# EAGLE design rcstick-f-pico (EAGLE 9.6.2)
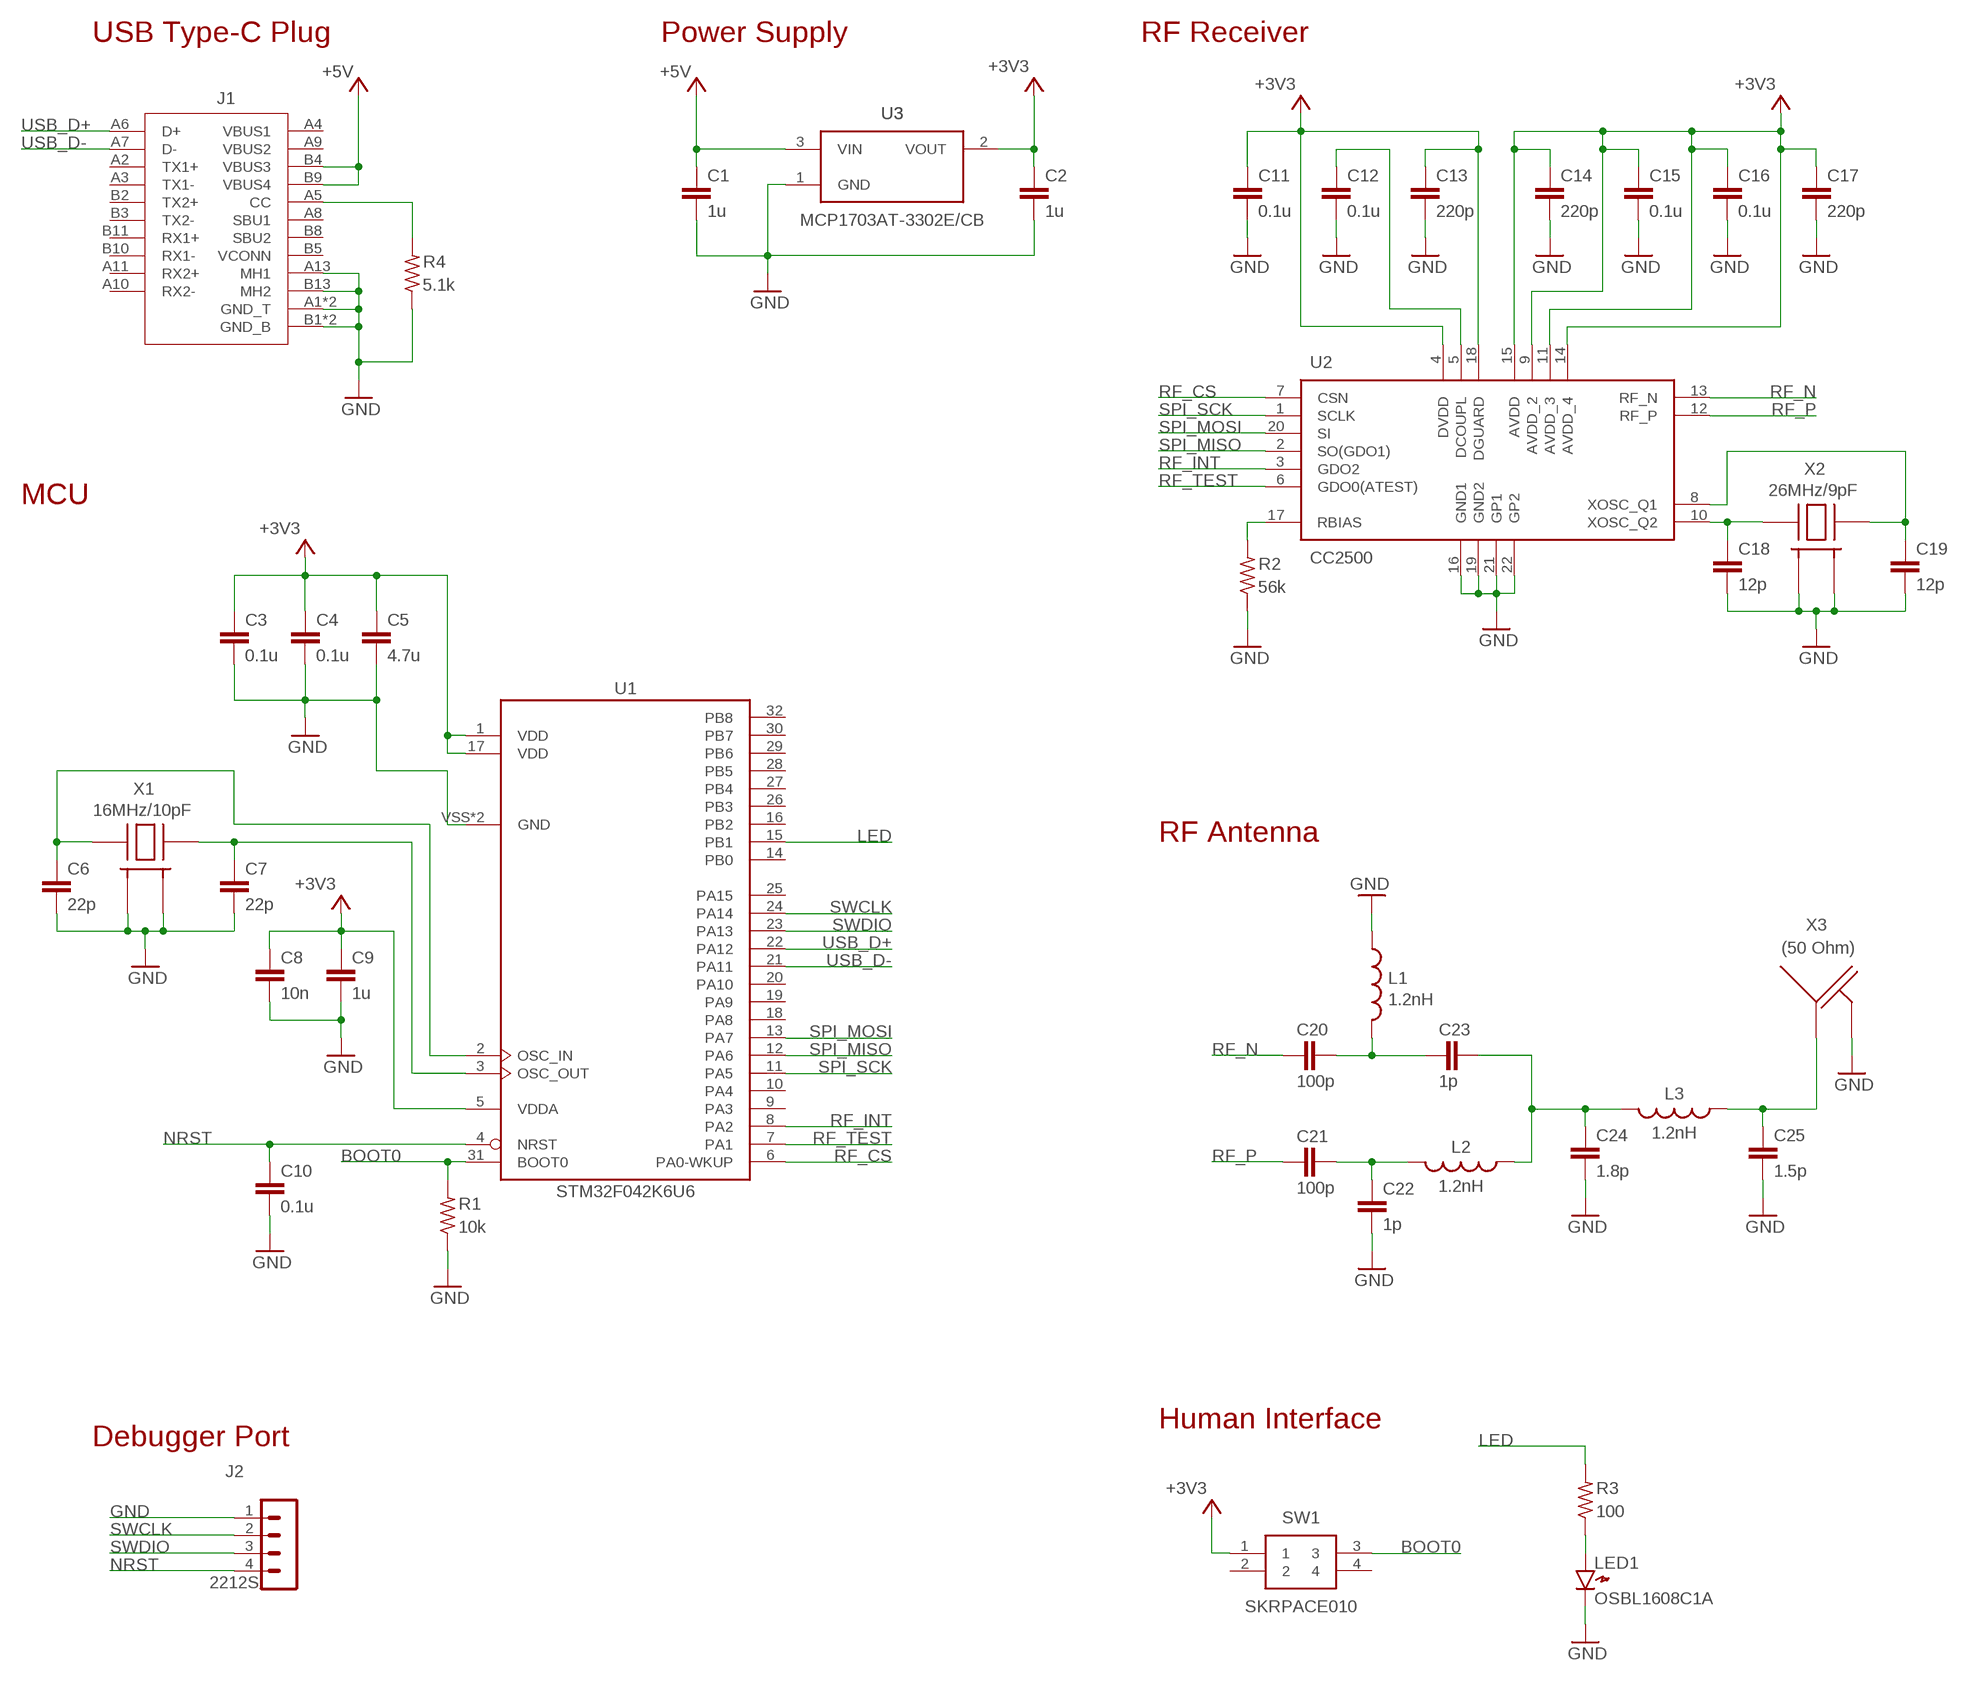
[diagram p0: schematic, sheet 1]

## Parts
C1  1u  RCL_C-EUC0402-HS  [RCL_C0402_HS]
C2  1u  RCL_C-EUC0402-HS  [RCL_C0402_HS]
C3  0.1u  RCL_C-EUC0402-HS  [RCL_C0402_HS]
C4  0.1u  RCL_C-EUC0402-HS  [RCL_C0402_HS]
C5  4.7u  RCL_C-EUC0402-HS  [RCL_C0402_HS]
C6  22p  RCL_C-EUC0402-HS  [RCL_C0402_HS]
C7  22p  RCL_C-EUC0402-HS  [RCL_C0402_HS]
C8  10n  RCL_C-EUC0402-HS  [RCL_C0402_HS]
C9  1u  RCL_C-EUC0402-HS  [RCL_C0402_HS]
C10  0.1u  RCL_C-EUC0402-HS  [RCL_C0402_HS]
C11  0.1u  RCL_C-EUC0402-HS  [RCL_C0402_HS]
C12  0.1u  RCL_C-EUC0402-HS  [RCL_C0402_HS]
C13  220p  RCL_C-EUC0402-HS  [RCL_C0402_HS]
C14  220p  RCL_C-EUC0402-HS  [RCL_C0402_HS]
C15  0.1u  RCL_C-EUC0402-HS  [RCL_C0402_HS]
C16  0.1u  RCL_C-EUC0402-HS  [RCL_C0402_HS]
C17  220p  RCL_C-EUC0402-HS  [RCL_C0402_HS]
C18  12p  RCL_C-EUC0402-HS  [RCL_C0402_HS]
C19  12p  RCL_C-EUC0402-HS  [RCL_C0402_HS]
C20  100p  RCL_C-EUC0402-HS  [RCL_C0402_HS]
C21  100p  RCL_C-EUC0402-HS  [RCL_C0402_HS]
C22  1p  RCL_C-EUC0402-HS  [RCL_C0402_HS]
C23  1p  RCL_C-EUC0402-HS  [RCL_C0402_HS]
C24  1.8p  RCL_C-EUC0402-HS  [RCL_C0402_HS]
C25  1.5p  RCL_C-EUC0402-HS  [RCL_C0402_HS]
J1  USB-TYPEC-1054440001-HS  [USB-TYPEC-1054440001-HS]
J2  2212S  53047-0410  [53047-0410]
L1  1.2nH  RCL_L-USL0402-HS  [RCL_L0402_HS]
L2  1.2nH  RCL_L-USL0402-HS  [RCL_L0402_HS]
L3  1.2nH  RCL_L-USL0402-HS  [RCL_L0402_HS]
LED1  OSBL1608C1A  LED1608  [LED1608]
R1  10k  RCL_R-US_R0402-HS  [RCL_R0402_HS]
R2  56k  RCL_R-US_R0402-HS  [RCL_R0402_HS]
R3  100  RCL_R-US_R0402-HS  [RCL_R0402_HS]
R4  5.1k  RCL_R-US_R0402-HS  [RCL_R0402_HS]
SW1  SKRPACE010  [SMT(4.2X3.2)]
U1  STM32F042K6U6  STM32F042K6U-M  [UQFPN32-M]
U2  CC2500  CC2500-HS  [CC2500-RTY1_CC2500-HS]
U3  MCP1703AT-3302E/CB  LDO-REGULATOR  [SOT23]
X1  16MHz/10pF  CRYSTAL3225HS  [CRYSTAL3225-HS]
X2  26MHz/9pF  CRYSTAL3225HS  [CRYSTAL3225-HS]
X3  (50 Ohm)  2.4GHZ-INVERED-FSMALL-FLIP  [2.4GHZ-INVERTED-F-SMALL-FLIP]

## Nets
+3V3 [pwr]: C2.1 C3.1 C4.1 C5.1 C8.1 C9.1 C11.1 C13.1 C14.1 C15.1 C16.1 C17.1 SW1.1 U1.1(VDD) U1.5(VDDA) U1.17(VDD) U2.4(DVDD) U2.9(AVDD_2) U2.11(AVDD_3) U2.14(AVDD_4) U2.15(AVDD) U2.18(DGUARD) U3.2(VOUT)
+5V [pwr]: C1.1 J1.B4(VBUS3) J1.B9(VBUS4) U3.3(VIN)
BOOT0: R1.2 SW1.3 U1.31(BOOT0)
CC: J1.A5(CC) R4.2
DCOUPL: C12.1 U2.5(DCOUPL)
GND [gnd]: C1.2 C2.2 C3.2 C4.2 C5.2 C6.2 C7.2 C8.2 C9.2 C10.2 C11.2 C12.2 C13.2 C14.2 C15.2 C16.2 C17.2 C18.2 C19.2 C22.2 C24.2 C25.2 J1.A1(GND_T) J1.A12(GND_T) J1.A13(MH1) J1.B1(GND_B) J1.B12(GND_B) J1.B13(MH2) J2.1 L1.1 LED1.K R1.1 R2.1 R4.1 U1.VSS(GND) U1.VSSH(GND) U2.16(GND1) U2.19(GND2) U2.21(GP1) U2.22(GP2) U3.1(GND) X1.2(GND_1) X1.4(GND_2) X2.2(GND_1) X2.4(GND_2) X3.2(GND)
LED: R3.2 U1.15(PB1)
N$1: LED1.A R3.1
N$5: C20.2 C23.1 L1.2
N$9: C21.2 C22.1 L2.2
N$10: C23.2 C24.1 L2.1 L3.2
N$11: C25.1 L3.1 X3.1(ANT)
NRST: C10.1 J2.4 U1.4(NRST)
OSC_IN: C6.1 U1.2(OSC_IN) X1.1(HOT_1)
OSC_OUT: C7.1 U1.3(OSC_OUT) X1.3(HOT_2)
RBIAS: R2.2 U2.17(RBIAS)
RF_CS: U1.6(PA0-WKUP) U2.7(CSN)
RF_INT: U1.8(PA2) U2.3(GDO2)
RF_N: C20.1 U2.13(RF_N)
RF_P: C21.1 U2.12(RF_P)
RF_TEST: U1.7(PA1) U2.6(GDO0(ATEST))
SPI_MISO: U1.12(PA6) U2.2(SO(GDO1))
SPI_MOSI: U1.13(PA7) U2.20(SI)
SPI_SCK: U1.11(PA5) U2.1(SCLK)
SWCLK: J2.2 U1.24(PA14)
SWDIO: J2.3 U1.23(PA13)
USB_D+: J1.A6(D+) U1.22(PA12)
USB_D-: J1.A7(D-) U1.21(PA11)
XOSC1: C19.1 U2.8(XOSC_Q1) X2.3(HOT_2)
XOSC2: C18.1 U2.10(XOSC_Q2) X2.1(HOT_1)
Unconnected: J1.A2(TX1+) J1.A3(TX1-) J1.A4(VBUS1) J1.A8(SBU1) J1.A9(VBUS2) J1.A10(RX2-) J1.A11(RX2+) J1.B2(TX2+) J1.B3(TX2-) J1.B5(VCONN) J1.B8(SBU2) J1.B10(RX1-) J1.B11(RX1+) SW1.2 SW1.4 U1.9(PA3) U1.10(PA4) U1.14(PB0) U1.16(PB2) U1.18(PA8) U1.19(PA9) U1.20(PA10) U1.25(PA15) U1.26(PB3) U1.27(PB4) U1.28(PB5) U1.29(PB6) U1.30(PB7) U1.32(PB8)

## Notes on the sheet
- USB Type-C Plug | Power Supply | RF Receiver
- MCU
- RF Antenna
- Human Interface
- Debugger Port

## Library data of the parts
C1-C25 = gen-discrete3:RCL_C-EU: CAPACITOR, European symbol
J1 = opiopan-libraries:USB-TYPEC-1054440001
J2 = connector:53047-0410: HEADER
L1-L3 = gen-discrete3:RCL_L-US: INDUCTOR, American symbol
LED1 = gen-discrete:LED: Generic LEDs
R1-R4 = gen-discrete3:RCL_R-US_: RESISTOR, American symbol
SW1 = SKRPACE010:SKRPACE010: Tactile Switches 4.2x3.2x2.5mm 260gf Source: Datasheet <http://www.alps.com/prod/info/E/HTML/Tact/SurfaceMount/SKRP/SKRPACE010.html>; ARROW_PART_NUMBER: SKRPACE010; DESCRIPTION: Tactile Switches 4.2x3.2x2.5mm 260gf; HEIGHT: mm; MANUFACTURER_NAME: ALPS; MANUFACTURER_PART_NUMBER: SKRPACE010
U1 = stm32:STM32F042K6U
U2 = CC2500:CC2500: RF Transceiver Source: Datasheet
U3 = SOT23_Module:LDO-REGULATOR
X1 X2 = CRYSTAL3225:CRYSTAL3225: Crystals 3225
X3 = antenna:2.4GHZ-INVERED-F

## Net classes
1 gnd: width 0.2 mm
2 pwr: width 0.2 mm

## Board
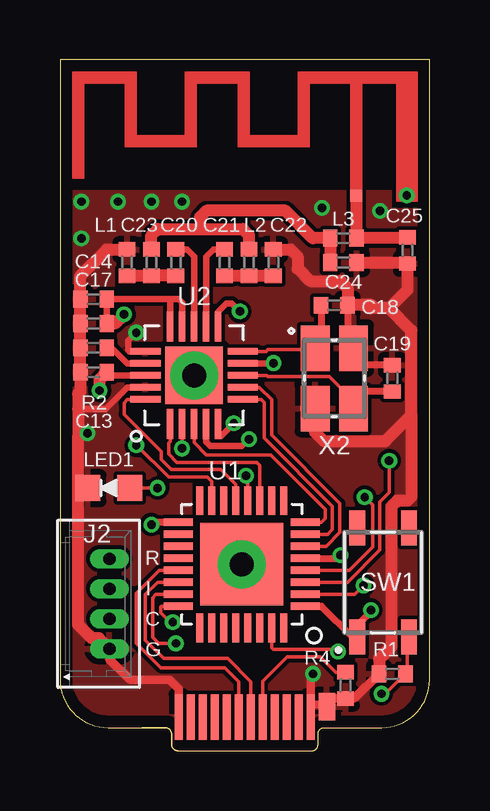
[diagram p1: board, top side]
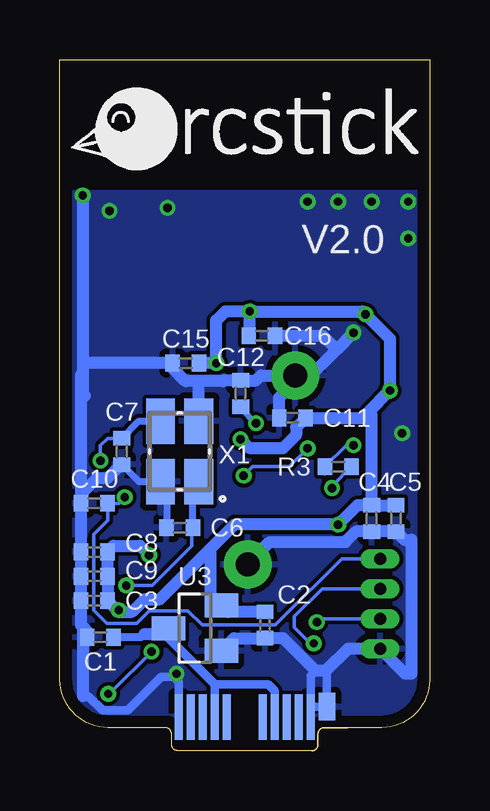
[diagram p2: board, bottom side, seen from below]

Size 15.4 x 28.8 mm. Coordinates in mm from the lower left corner, seen from the top.
Outline: 15.4,28.8 0,28.8 0,2.96 arc90 2,0.96 4.4,0.96 arc-90 4.65,0.71 4.65,0.25 arc90 4.9,0 10.5,0 arc90 10.75,0.25 10.75,0.71 arc-90 11,0.96 13.4,0.96 arc90 15.4,2.96 15.4,28.8
Copper layers (1*16): Top 0.035mm / dielectric 0.73mm / Bottom 0.035mm
Design rules "Elecrow_2-layer_PCB_eagle_rule *": minimum track width 6mil, minimum drill 12mil, track to track 6mil, track to pad 6mil, pad to pad 6mil, via to via 8mil, smd to smd 0mil, copper to edge 20mil, drill to drill 10mil, minimum pad ring 6mil, minimum via ring 6mil, stop-mask expansion 0mil, vias tented up to drill 100mil, thermal gap 10mil
tRestrict: area 9.5,4.7 to 9.7,5.6; area 3,16.8 to 4.2,17; area 11.8,15.5 to 12.6,15.8
bRestrict: area 8.9,12.2 to 11.5,12.8

### Footprints (pad centres in the part's own frame; a part is rotated, then mirrored left to right if it is on the bottom)
RCL_C0402_HS = smd 0.6 x 0.7: 1 -0.55,0; 2 0.55,0
USB-TYPEC-1054440001-HS = smd 0.345 x 1.9: A1 -2.75,0.59; A2 -2.25,0.59; A3 -1.75,0.59; A4 -1.25,0.59; A5 -0.75,0.59; A6 -0.25,0.59; A7 0.25,0.59; A8 0.75,0.59; A9 1.25,0.59; A10 1.75,0.59; A11 2.25,0.59; A12 2.75,0.59 | smd 0.69 x 1.15: A13 -3.42,0.16 | smd 0.345 x 1.9 bottom: B1 2.75,0.59; B2 2.25,0.59; B3 1.75,0.59; B4 1.25,0.59; B5 0.75,0.59; B8 -0.75,0.59; B9 -1.25,0.59; B10 -1.75,0.59; B11 -2.25,0.59; B12 -2.75,0.59 | smd 0.69 x 1.15 bottom: B13 3.42,0.16
53047-0410 = drill 0.508 long: 1 1.875,0; 2 0.625,0; 3 -0.625,0; 4 -1.875,0
RCL_L0402_HS = smd 0.6 x 0.7: 1 -0.55,0; 2 0.55,0
LED1608 = smd 1.05 x 1.08: A -0.875,0; K 0.875,0
RCL_R0402_HS = smd 0.6 x 0.7: 1 -0.55,0; 2 0.55,0
SMT(4.2X3.2) = smd 1.45 x 0.65: 1 -2.275,1.075; 2 2.275,1.075; 3 -2.275,-1.075; 4 2.275,-1.075
UQFPN32-M = smd 1.2 x 0.3: 1 -2.65,1.75; 2 -2.65,1.25; 3 -2.65,0.75; 4 -2.65,0.25; 5 -2.65,-0.25; 6 -2.65,-0.75; 7 -2.65,-1.25; 8 -2.65,-1.75; 17 2.65,-1.75; 18 2.65,-1.25; 19 2.65,-0.75; 20 2.65,-0.25; 21 2.65,0.25; 22 2.65,0.75; 23 2.65,1.25; 24 2.65,1.75 | smd 0.3 x 1.2: 9 -1.75,-2.65; 10 -1.25,-2.65; 11 -0.75,-2.65; 12 -0.25,-2.65; 13 0.25,-2.65; 14 0.75,-2.65; 15 1.25,-2.65; 16 1.75,-2.65; 25 1.75,2.65; 26 1.25,2.65; 27 0.75,2.65; 28 0.25,2.65; 29 -0.25,2.65; 30 -0.75,2.65; 31 -1.25,2.65; 32 -1.75,2.65 | smd 3.45 x 3.45: VSS 0,0 | drill 1 pad 2: VSSH 0,0
CC2500-RTY1_CC2500-HS = smd 1.26 x 0.28: 1 -2.03,1; 2 -2.03,0.5; 3 -2.03,0; 4 -2.03,-0.5; 5 -2.03,-1; 11 2.03,-1; 12 2.03,-0.5; 13 2.03,0; 14 2.03,0.5; 15 2.03,1 | smd 0.28 x 1.26: 6 -1,-2.03; 7 -0.5,-2.03; 8 0,-2.03; 9 0.5,-2.03; 10 1,-2.03; 16 1,2.03; 17 0.5,2.03; 18 0,2.03; 19 -0.5,2.03; 20 -1,2.03 | smd 2.4 x 2.4: 21 0,0 | drill 1 pad 2: 22 0,0
SOT23 = smd 1 x 1.4: 1 -0.95,-1.1; 2 0.95,-1.1; 3 0,1.1
CRYSTAL3225-HS = smd 1.9 x 1.2: 1 -1.26,-0.8; 2 1.26,-0.8; 3 1.26,0.8; 4 -1.26,0.8
2.4GHZ-INVERTED-F-SMALL-FLIP = smd 0.5 x 0.5: 1 12.35,-5.45 | drill 0.35 pad 0.5: 2 14.45,-5.45

### Placement (x,y rotation side)
C1  13.72,4.73 180 bottom
C2  6.86,5.24 270 bottom
C3  13.97,6.26 180 bottom
C4  2.41,9.68 270 bottom
C5  1.4,9.68 270 bottom
C6  10.41,9.3 180 bottom
C7  12.83,12.48 270 bottom
C8  13.97,7.27 180 bottom
C9  13.97,8.29 180 bottom
C10  13.97,10.32 180 bottom
C11  5.71,13.88 180 bottom
C12  7.87,14.89 90 bottom
C13  1.4,15.78 180 top
C14  1.4,18.83 180 top
C15  10.16,16.16 180 bottom
C16  6.99,17.3 0 bottom
C17  1.4,17.81 180 top
C18  11.43,18.57 0 top
C19  13.84,15.53 90 top
C20  4.83,20.35 270 top
C21  6.86,20.35 270 top
C22  8.89,20.35 90 top
C23  3.81,20.35 90 top
C24  11.81,20.35 0 top
C25  14.48,20.86 270 top
J1  7.7,2 180 top
J2  2.06,6.13 270 top
L1  2.79,20.35 270 top
L2  7.87,20.35 270 top
L3  11.81,21.37 180 top
LED1  2.03,10.95 180 top
R1  13.84,3.21 0 top
R2  1.4,16.8 0 top
R3  3.81,11.84 180 bottom
R4  11.9,2.73 90 top
SW1  13.46,7.02 90 top
U1  7.57,7.78 180 top
U2  5.59,15.65 90 top
U3  9.78,5.11 90 bottom
U$1  [RCSTICK-LOGO]  15.37,21.75 0 bottom
X1  10.41,12.48 90 bottom
X2  11.43,15.53 270 top
X3  0,28.6 0 top

### Tracks (layer width: path | path; a pad name or v marks a point on that pad's centre or on a via)
+3V3  (via drill 0.35)
  Top 0.28: U2.18 2.07,15.65 C13.1 | U2.9 v8.88,16.15 v8.89,16.16 | C17.1 C14.1 4.57,18.83 | v7.87,12.99 7.57,12.7 6.25,12.7 6.09,12.87 U2.4 | U2.11 6.59,18.3 6.93,18.65 7.16,18.65 v7.49,18.32 | U2.14 5.09,18.69 4.95,18.83 4.57,18.83 | U2.15 4.59,18.81 4.57,18.83
  Top 0.3: v3.81,9.43 3.91,9.53 U1.17 | U1.5 11.55,8.03 v11.68,8.16 | U1.1 10.89,6.03 12.18,4.74 SW1.1 12.39,5.23 12.95,5.79 v12.95,5.87
  Top 0.5: v1.65,15.02 1.65,15.48 C13.1 | C17.1 2.29,17.81 v2.67,18.19
  Bottom 0.5: C2.1 8.41,5.79 U3.2 9.14,6.53 9.14,8.41 | C15.1 v8.89,16.16 8.89,17.94 8.51,18.32 v7.49,18.32 | 11.63,8.11 v11.68,8.16 12.06,8.54 13.17,8.54 C9.1 C8.1 C3.1 12.96,5.79 12.95,5.79 | C4.1 C5.1 | C4.1 3.01,10.23 v3.81,9.43 | v3.81,9.43 3.83,9.43 | 2.54,14.13 2.79,13.88 C11.1 5.56,13.48 5.56,13.15 6.11,12.61 7.49,12.61 v7.87,12.99 | 2.54,14.13 v1.65,15.02 1.65,17.18 v2.67,18.19 2.79,18.32 v7.49,18.32 | C4.1 2.41,14 2.54,14.13 | v3.81,9.43 8.13,9.43 9.14,8.41 | C16.1 7.49,17.35 v7.49,18.32 | 9.14,8.41 11.24,6.32 11.87,6.32 12.4,5.79 12.95,5.79 | v12.95,5.87 12.95,5.79
+5V
  Bottom 0.34: 11.88,4.86 12.02,4.73 C1.1
  Bottom 0.345: J1.B9 8.95,2.76 | 8.95,2.76 10.88,4.69 U3.3 | J1.B4 6.45,2.49 6.72,2.76 8.95,2.76
  Bottom 0.38: 10.92,5.11 11.1,5.11
  Bottom 0.5: U3.3 10.96,5.2 | U3.3 10.96,5.03 | U3.3 11.1,5.11 11.35,4.86 11.88,4.86
BOOT0  (via drill 0.35)
  Top 0.152: SW1.3 14.48,4.68 14.48,3.21 R1.2 13.67,2.48 13.5,2.48 v13.39,2.37 | U1.31 8.82,4.29 8.89,4.22 11.49,4.22 v11.58,4.13
  Bottom 0.152: v11.58,4.13 13.23,2.48 13.28,2.48 v13.39,2.37
CC
  Top 0.152: J1.A5 8.45,2.89 9.47,3.92 10.85,3.92 11.49,3.28 R4.2
DCOUPL  (via drill 0.35)
  Top 0.28: 7.12,13.65 v7.24,13.65 6.72,13.13 6.59,13.13 U2.5
  Bottom 0.28: C12.1 7.87,14.29 v7.24,13.65
GND  (via drill 0.35)
  Top 0.28: U2.19 2.8,15.15 1.91,14.26 0.76,14.26 | U2.16 2.91,16.65 2.85,16.72 2.85,17.1 v3.17,17.43
  Top 0.3: C18.2 11.98,17.04 | C19.2 12.32,16.08
  Top 0.34: J1.B12 10.45,1.85 10.54,1.94 11.02,1.94 J1.A13
  Top 0.345: J1.B1 4.95,2.58 4.57,2.95 2.92,2.95 2.06,3.81 J2.1 | J1.B12 10.45,3.12 v10.54,3.21 | 0.76,10.7 0.9,10.7 LED1.K 0.76,11.35
  Top 0.36: R1.1 12.26,2.18 R4.1 11.46,2.18 J1.A13
  Top 0.5: 13.72,18.45 12.95,18.45 13,18.49 | 13,18.57 C18.2 | 14.64,14 14.64,10.58 14.48,10.42 14.04,10.42 13.81,10.18 13.81,4.35 13.29,3.83 R1.1 | 14.64,14 14.64,17.52 13.72,18.45 | 11.98,17.04 X2.4 12.23,16.16 12.32,16.08 | C17.2 0.89,17.85 | C18.2 11.94,18.62 | X2.2 10.63,13.28 10.99,12.91 13.55,12.91 14.64,14 | C17.2 R2.1 C13.2 0.85,14.98 0.76,14.89 0.76,14.26 0.76,13.1 0.76,11.97 0.76,10.7 0.76,5.26 1.32,4.69 1.62,4.69 J2.1 | C17.2 C14.2 0.85,19.8 1.95,20.9 L1.1 | C22.2 9.61,20.9 9.91,20.61 9.91,20.1 10.41,19.59 11.68,19.59 11.98,19.29 C18.2 | C24.2 14.44,20.35 C25.2 14.48,19.21 13.72,18.45
  Bottom 0.3: C6.2 10.92,9.35 10.92,10.93 X1.4 12.12,11.22 C7.2
  Bottom 0.345: J1.B12 10.45,2.86 10.67,3.08 11.18,3.08 12.57,1.68 13.62,1.68 14.22,2.28 14.44,2.28 | 4.95,1.64 4.95,1.84 J1.B13 4.28,3.3 4.32,3.33 | 2.08,4.24 J2.1 | J1.B1 4.95,3.13 4.75,3.33
  Bottom 0.38: 4.98,3.56 4.95,3.54
  Bottom 0.5: 2.73,4.25 J2.1 | 4.98,3.56 6.1,4.69 C2.2 8.15,4.69 U3.1 | X3.2 14.45,16.03 | 14.45,16.03 14.45,14.89 14.37,14.81 | U2.22 7.03,15.65 7.24,15.44 C12.2 8.58,15.44 8.61,15.41 9.65,15.41 | 14.52,10.7 C10.2 C9.2 C8.2 C3.2 14.52,5.24 14.44,5.15 | 14.52,10.7 14.52,15.67 | C11.2 6.26,14.72 5.59,15.4 U2.22 | 9.65,15.41 10.15,15.41 10.16,15.4 10.71,15.95 C15.2 14.32,16.16 14.45,16.03 | 14.52,10.7 13.85,11.37 13.41,11.37 12.85,11.93 C7.2 | X1.2 9.61,15.37 9.65,15.41 | v3.17,17.43 3.87,16.73 | 3.87,16.73 4.95,15.65 U2.22 | 3.87,16.73 4.45,17.3 C16.2 | J2.1 1.02,3.21 0.76,3.21 0.76,8.79 1.06,8.79 C5.2 C4.2 3.07,9.13 3.51,8.7 6.65,8.7 U1.VSSH | J2.1 3.4,4.25 4.32,3.33 4.75,3.33 4.95,3.54 | 14.44,5.15 14.27,4.99 C1.2 | 14.44,2.28 14.44,5.15
  other vias: 1.14,13.24 13.34,22.51 10.92,22.64 5.08,22.89 3.81,22.89 2.41,22.89 0.89,22.89 0.89,21.37
  pour Top: 0,-2.13 15.49,-2.13 15.49,23.65 0,23.65
  pour Bottom: -0.38,-2.51 15.88,-2.51 15.88,24.04 -0.38,24.04
LED  (via drill 0.35)
  Top 0.152: v3.17,12.73 3.2,12.73 4.52,11.41 5.79,11.41 5.8,11.42 6.14,11.42 6.32,11.23 U1.15
  Bottom 0.152: 4.36,11.55 R3.2 3.47,12.73 v3.17,12.73
N$1  (via drill 0.35)
  Top 0.152: LED1.A v4.06,10.95
  Bottom 0.152: R3.1 3.26,11.76 | R3.1 3.3,11.8 | R3.1 4.06,11.04 v4.06,10.95
N$5
  Top 0.5: C20.2 C23.1 L1.2
N$9
  Top 0.5: C21.2 L2.2 C22.1
N$10
  Top 0.5: C23.2 3.81,21.5 4.06,21.75 5.84,21.75 | L2.1 7.87,21.5 7.62,21.75 5.84,21.75 | 5.84,21.75 5.84,22.26 6.1,22.51 9.4,22.51 10.54,21.37 L3.2 C24.1
N$11
  Top 0.5: C25.1 14.44,21.37 L3.1 X3.1
NRST  (via drill 0.35)
  Top 0.152: v12.7,10.57 13.03,10.25 13.03,8.49 12.06,7.53 U1.4
  Bottom 0.152: v12.7,10.57 12.95,10.32 C10.1 13.42,9.6 13.99,9.03 13.99,5.85 13.45,5.31 12.21,5.31 11.67,5.84 10.08,5.84 9.48,5.24 6.42,5.24 6.2,5.47 | 6.2,5.47 6.21,5.47 | J2.4 3.66,8 6.2,5.47
OSC_IN  (via drill 0.35)
  Top 0.152: U1.2 12.28,6.53 v12.64,6.89
  Bottom 0.152: C6.1 9.91,9.26 9.91,8.54 11.56,6.89 v12.64,6.89
  Bottom 0.3: C6.1 9.86,10.97 X1.1
OSC_OUT  (via drill 0.35)
  Top 0.152: v13.72,12.1 13.72,10.77 13.33,10.38 13.33,8.37 11.99,7.03 U1.3
  Bottom 0.152: C7.1 13.42,13.03 13.72,12.73 v13.72,12.1
  Bottom 0.3: C7.1 12.12,13.74 X1.3
RBIAS
  Top 0.28: U2.17 2.8,16.15 2.16,16.8 R2.2
RF_CS
  Top 0.152: U2.7 8.3,15.14 8.81,14.64 8.81,13.16 11.66,10.32 11.66,9.1 11.09,8.53 U1.6
RF_INT
  Top 0.152: U2.3 5.59,12.85 6.1,12.33 8.78,12.33 11.05,10.06 11.05,9.68 10.89,9.53 U1.8
RF_N
  Top 0.28: C20.1 5.29,20.9 5.59,20.61 U2.13
RF_P
  Top 0.28: U2.12 6.09,20.6 6.39,20.9 C21.1
RF_TEST
  Top 0.152: U2.6 7.63,14.64 8.38,14.64 8.51,14.51 8.51,13.04 11.35,10.19 11.35,9.23 11.16,9.03 U1.7
SPI_MISO  (via drill 0.35)
  Top 0.152: U2.2 v5.09,12.61 v5.08,12.61 | v7.75,11.46 7.82,11.39 U1.12
  Bottom 0.152: v5.08,12.61 5.84,11.84 7.37,11.84 v7.75,11.46
SPI_MOSI
  Top 0.152: U2.20 3.54,14.64 2.81,14.64 2.67,14.5 2.67,14.03 4.22,12.47 4.22,12.15 4.64,11.72 6.7,11.72 7.32,11.1 U1.13
SPI_SCK
  Top 0.152: U2.1 4.59,12.9 4.52,12.84 4.52,12.38 4.87,12.03 8.2,12.03 8.32,11.9 U1.11
SWCLK  (via drill 0.35)
  Top 0.152: U1.24 4.22,6.03 4.19,6 4.19,5.75 4.57,5.37 v4.7,5.37
  Bottom 0.152: J2.2 4.56,5.5 v4.7,5.37
SWDIO  (via drill 0.35)
  Top 0.152: v4.83,4.48 4.12,4.48 3.87,4.73 3.87,6.38 4,6.51 4.9,6.51 U1.23
  Bottom 0.152: v4.83,4.48 4.98,4.48 5.64,5.14 5.64,5.6 4.48,6.75 J2.3
USB_D+
  Top 0.152: U1.22 4.08,7.03 3.56,6.51 3.56,4.6 4.32,3.84 6.99,3.84 7.95,2.88 J1.A6
USB_D-
  Top 0.152: J1.A7 7.45,2.87 6.86,3.46 4.19,3.46 3.17,4.48 3.17,6.56 4.14,7.53 U1.21
XOSC1
  Top 0.152: X2.3 12.23,14.6 11.22,15.61 8.66,15.61 8.61,15.65 U2.8
  Top 0.3: C19.1 12.4,14.98
  Top 0.5: 12.4,14.98 12.32,14.89 12.32,14.36 X2.3
XOSC2
  Top 0.152: U2.10 8.6,16.65 8.66,16.72 10.56,16.72 X2.1
  Top 0.3: C18.1 10.88,17.04
  Top 0.5: 10.88,17.04 X2.1

### Text on the board
bPlace: V2.0
tNames: LED1 | R | I | C | G